# EAGLE schematic OSHW_STEPPER_DRIVER (EAGLE 6.2)
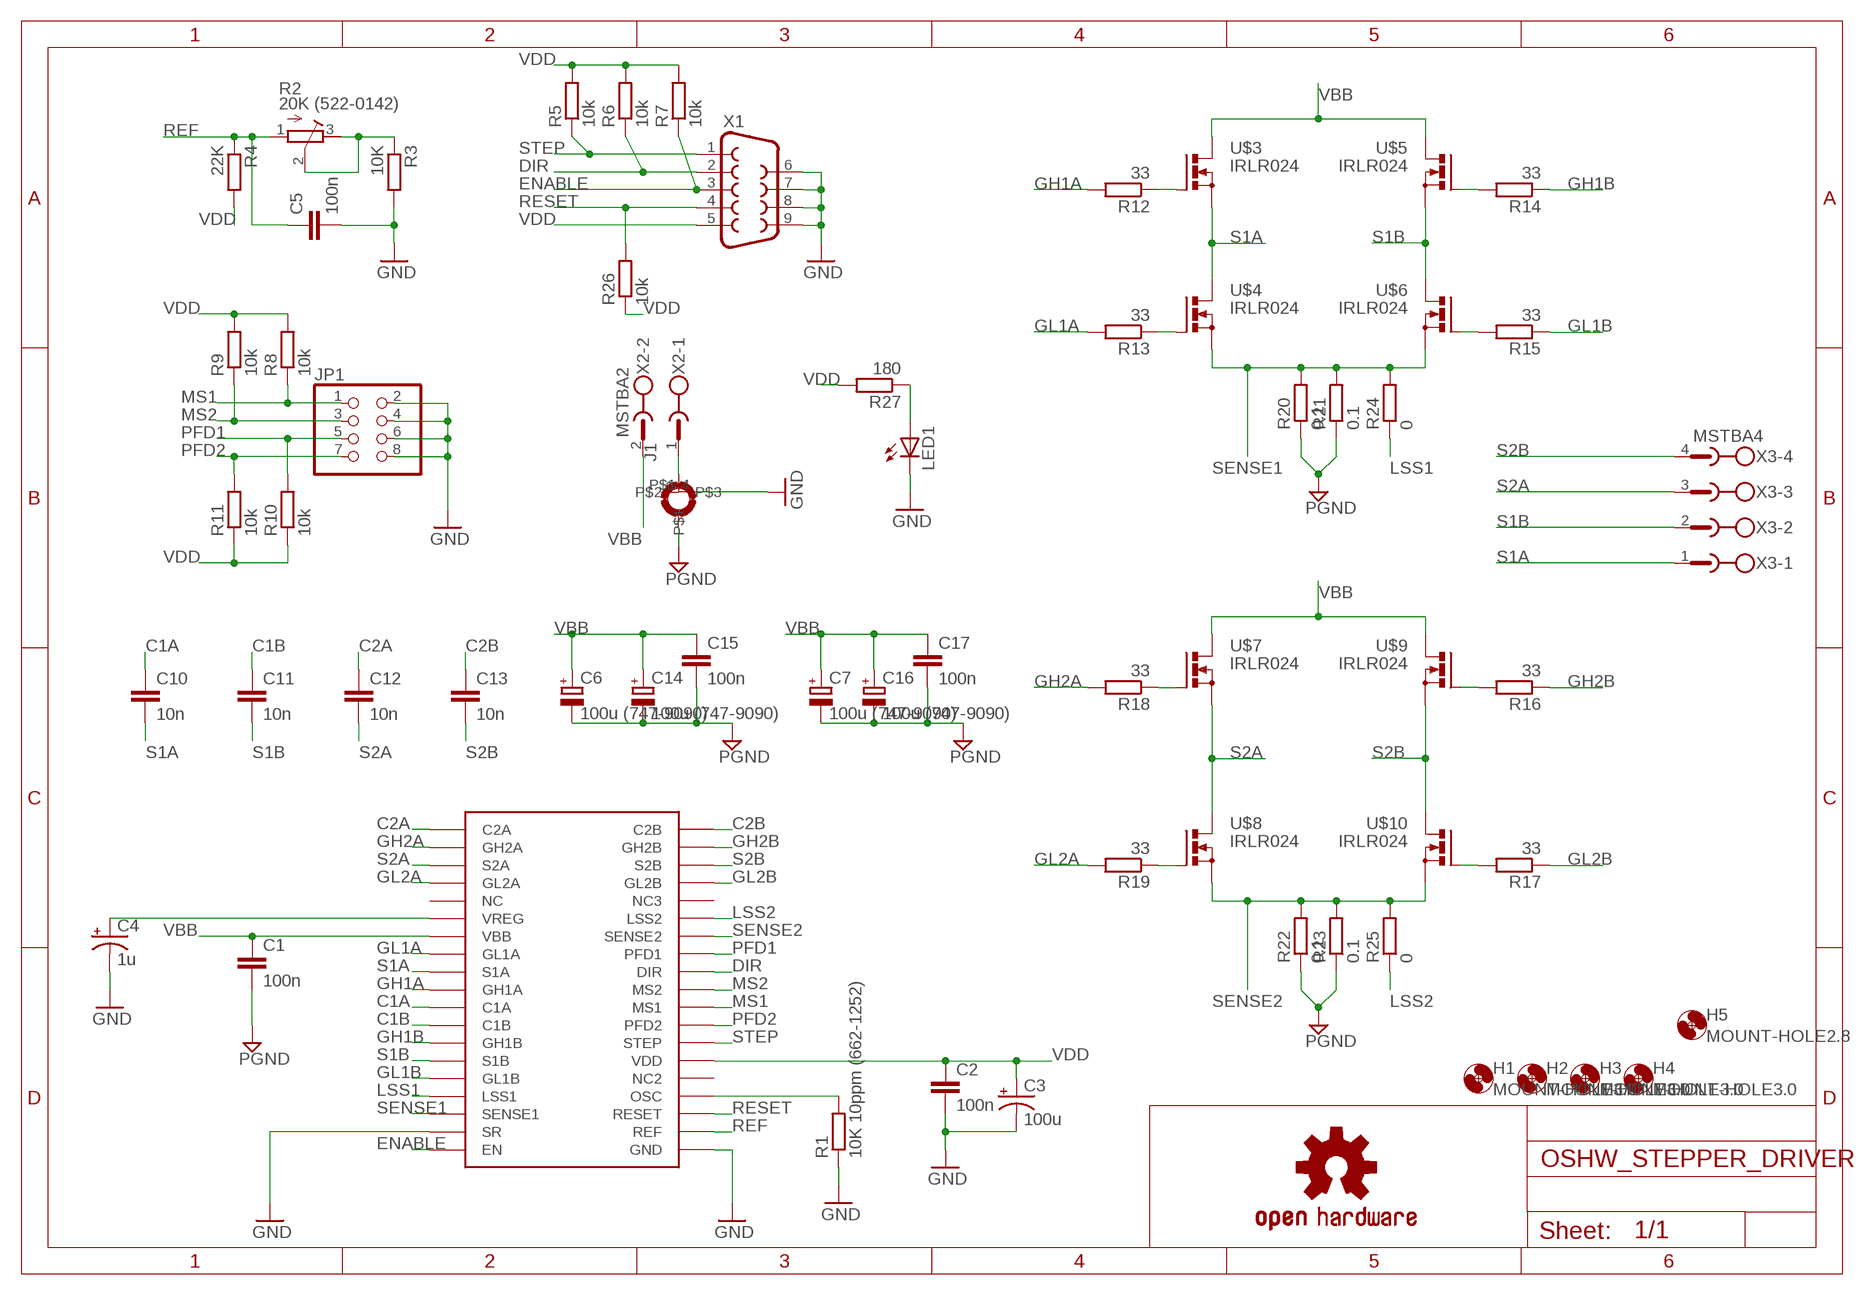
[diagram p0: schematic, sheet 1]

## Parts
C1  100n  C-EUC0805  [C0805]
C2  100n  C-EUC0805  [C0805]
C3  100u  CPOL-US153CLV-0605  [153CLV-0605]
C4  1u  CPOL-US153CLV-0405  [153CLV-0405]
C5  100n  C-EUC0805  [C0805]
C6  100u (747-9090)  CPOL-EUG  [PANASONIC_G]
C7  100u (747-9090)  CPOL-EUG  [PANASONIC_G]
C10  10n  C-EUC0805  [C0805]
C11  10n  C-EUC0805  [C0805]
C12  10n  C-EUC0805  [C0805]
C13  10n  C-EUC0805  [C0805]
C14  100u (747-9090)  CPOL-EUG  [PANASONIC_G]
C15  100n  C-EUC1210  [C1210]
C16  100u (747-9090)  CPOL-EUG  [PANASONIC_G]
C17  100n  C-EUC1210  [C1210]
H1  MOUNT-HOLE3.0  [3,0]
H2  MOUNT-HOLE3.0  [3,0]
H3  MOUNT-HOLE3.0  [3,0]
H4  MOUNT-HOLE3.0  [3,0]
H5  MOUNT-HOLE2.8  [2,8]
J1  STARBOARD_GND  [STARBOARD_GROUND]
JP1  PINHD-2X4  [2X04]
LED1  LEDSIDELED  [OSRAM-SIDELED]
R1  10K 10ppm (662-1252)  R-EU_R0805  [R0805]
R2  20K (522-0142)  R-TRIMM3296P  [RTRIM3296P]
R3  10K  R-EU_R0603  [R0603]
R4  22K  R-EU_R0603  [R0603]
R5  10k  R-EU_R0603  [R0603]
R6  10k  R-EU_R0603  [R0603]
R7  10k  R-EU_R0603  [R0603]
R8  10k  R-EU_R0603  [R0603]
R9  10k  R-EU_R0603  [R0603]
R10  10k  R-EU_R0603  [R0603]
R11  10k  R-EU_R0603  [R0603]
R12  33  R-EU_R0603  [R0603]
R13  33  R-EU_R0603  [R0603]
R14  33  R-EU_R0603  [R0603]
R15  33  R-EU_R0603  [R0603]
R16  33  R-EU_R0603  [R0603]
R17  33  R-EU_R0603  [R0603]
R18  33  R-EU_R0603  [R0603]
R19  33  R-EU_R0603  [R0603]
R20  0.1  R-EU_R2512  [R2512]
R21  0.1  R-EU_R2512  [R2512]
R22  0.1  R-EU_R2512  [R2512]
R23  0.1  R-EU_R2512  [R2512]
R24  0  R-EU_R0805  [R0805]
R25  0  R-EU_R0805  [R0805]
R26  10k  R-EU_R0603  [R0603]
R27  180  R-EU_R0603  [R0603]
U$1  OSHW-LOGOM  [OSHW-LOGO-M]
U$2  A4989  [TSSOP38]
U$3  IRLR024  [D-PAK_TO252AA]
U$4  IRLR024  [D-PAK_TO252AA]
U$5  IRLR024  [D-PAK_TO252AA]
U$6  IRLR024  [D-PAK_TO252AA]
U$7  IRLR024  [D-PAK_TO252AA]
U$8  IRLR024  [D-PAK_TO252AA]
U$9  IRLR024  [D-PAK_TO252AA]
U$10  IRLR024  [D-PAK_TO252AA]
X1  DB9FEMALE  [DB9]
X2  MSTBA2  [MSTBA2]
X3  MSTBA4  [MSTBA4]

## Nets
C1A: C10.1 U$2.P$11(C1A)
C1B: C11.1 U$2.P$12(C1B)
C2A: C12.1 U$2.P$1(C2A)
C2B: C13.1 U$2.P$38(C2B)
DIR: R6.1 U$2.P$30(DIR) X1.2
ENABLE: R7.1 U$2.P$19(EN) X1.3
GH1A: R12.2 U$2.P$10(GH1A)
GH1B: R14.1 U$2.P$13(GH1B)
GH2A: R18.2 U$2.P$2(GH2A)
GH2B: R16.1 U$2.P$37(GH2B)
GL1A: R13.2 U$2.P$8(GL1A)
GL1B: R15.1 U$2.P$15(GL1B)
GL2A: R19.2 U$2.P$4(GL2A)
GL2B: R17.1 U$2.P$35(GL2B)
GND: C2.2 C3.- C4.- C5.2 J1.1(MOUNT) JP1.2 JP1.4 JP1.6 JP1.8 LED1.C R1.1 R3.2 U$2.P$18(SR) U$2.P$20(GND) X1.6 X1.7 X1.8 X1.9 ; supply symbol labelled PGND
LSS1 [LSS (low impedance)]: R24.1 U$2.P$16(LSS1)
LSS2 [LSS (low impedance)]: R25.1 U$2.P$33(LSS2)
MS1: JP1.1 R8.1 U$2.P$28(MS1)
MS2: JP1.3 R9.1 U$2.P$29(MS2)
N$1: C4.+ U$2.P$6(VREG)
N$2: R1.2 U$2.P$23(OSC)
N$3: R2.2(S) R2.3(A) R3.1
N$4: J1.2 X2.1
N$8: R12.1 U$3.G(GATE)
N$9: R13.1 U$4.G(GATE)
N$10: R14.2 U$5.G(GATE)
N$11: R15.2 U$6.G(GATE)
N$12: R16.2 U$9.G(GATE)
N$13: R17.2 U$10.G(GATE)
N$14: R18.1 U$7.G(GATE)
N$15: R19.1 U$8.G(GATE)
N$17: LED1.A R27.1
PFD1: JP1.5 R10.2 U$2.P$31(PFD1)
PFD2: JP1.7 R11.2 U$2.P$27(PFD2)
PGND: C1.2 C6.- C7.- C14.- C15.2 C16.- C17.2 J1.4 R20.1 R21.1 R22.1 R23.1 ; supply symbol labelled GND
REF: C5.1 R2.1(E) R4.1 U$2.P$21(REF)
RESET: R26.2 U$2.P$22(RESET) X1.4
S1A [MOTOR POWER]: C10.2 U$2.P$9(S1A) U$3.S(SOURCE) U$4.D(DRAIN) U$4.DRAIN-BOTTOM(DRAIN) X3.1
S1B [MOTOR POWER]: C11.2 U$2.P$14(S1B) U$5.S(SOURCE) U$6.D(DRAIN) U$6.DRAIN-BOTTOM(DRAIN) X3.2
S2A [MOTOR POWER]: C12.2 U$2.P$3(S2A) U$7.S(SOURCE) U$8.D(DRAIN) U$8.DRAIN-BOTTOM(DRAIN) X3.3
S2B [MOTOR POWER]: C13.2 U$2.P$36(S2B) U$9.S(SOURCE) U$10.D(DRAIN) U$10.DRAIN-BOTTOM(DRAIN) X3.4
SENSE1 [MOTOR POWER]: R20.2 R21.2 R24.2 U$2.P$17(SENSE1) U$4.S(SOURCE) U$6.S(SOURCE)
SENSE2 [MOTOR POWER]: R22.2 R23.2 R25.2 U$2.P$32(SENSE2) U$8.S(SOURCE) U$10.S(SOURCE)
STEP: R5.1 U$2.P$26(STEP) X1.1
VBB [MOTOR POWER]: C1.1 C6.+ C7.+ C14.+ C15.1 C16.+ C17.1 U$2.P$7(VBB) U$3.D(DRAIN) U$3.DRAIN-BOTTOM(DRAIN) U$5.D(DRAIN) U$5.DRAIN-BOTTOM(DRAIN) U$7.D(DRAIN) U$7.DRAIN-BOTTOM(DRAIN) U$9.D(DRAIN) U$9.DRAIN-BOTTOM(DRAIN) X2.2
VDD: C2.1 C3.+ R4.2 R5.2 R6.2 R7.2 R8.2 R9.2 R10.1 R11.1 R26.1 R27.2 U$2.P$25(VDD) X1.5
Unconnected: J1.P$1 U$2.P$5(NC) U$2.P$24(NC2) U$2.P$34(NC3)

## Library data of the parts
C1 C2 C5 C10-C13 C15 C17 = rcl:C-EU: CAPACITOR, European symbol
C3 C4 = rcl:CPOL-US: POLARIZED CAPACITOR, American symbol
C6 C7 C14 C16 = rcl:CPOL-EU: POLARIZED CAPACITOR, European symbol
H1-H5 = holes:MOUNT-HOLE: MOUNTING HOLE with drill center marker
J1 = STAR_POINTS:STARBOARD_GND: StarBoard ground Pad Starboard pads sans the star cutout in top layer
JP1 = pinhead:PINHD-2X4: PIN HEADER
LED1 = led:LED: LED OSRAM: - CHIPLED LG R971, LG N971, LY N971, LG Q971, LY Q971, LO R971, LY R971 LH N974, LH R974 LS Q976, LO Q976, LY Q976 LO Q996 - Hyper CHIPLED LW Q18S LB Q993, LB Q99A, LB R99A - SideLED LS A670, LO A670, LY A670, LG A670, LP A670 LB A673, LV A673, LT A673, LW A673 LH A674 LY A675 LS A676, LA A676, LO A676, LY A676, LW A676 LS A679, LY A679, LG A679 - Hyper Micro SIDELED® LS Y876, LA Y876, LO Y876, LY Y876 LT Y87S - SmartLED LW L88C, LW L88S LB L89C, LB L89S, LG L890 LS L89K, LO L89K, LY L89K LS L896, LA L896, LO L896, LY L896 - TOPLED LS T670, LO T670, LY T670, LG T670, LP T670 LSG T670, LSP T670, LSY T670, LOP T670, LYG T670 LG T671, LOG T671, LSG T671 LB T673, LV T673, LT T673, LW T673 LH T674 LS T676, LA T676, LO T676, LY T676, LB T676, LH T676, LSB T676, LW T676 LB T67C, LV T67C, LT T67C, LS T67K, LO T67K, LY T67K, LW E67C LS E67B, LA E67B, LO E67B, LY E67B, LB E67C, LV E67C, LT E67C LW T67C LS T679, LY T679, LG T679 LS T770, LO T770, LY T770, LG T770, LP T770 LB T773, LV T773, LT T773, LW T773 LH T774 LS E675, LA E675, LY E675, LS T675 LS T776, LA T776, LO T776, LY T776, LB T776 LHGB T686 LT T68C, LB T68C - Hyper Mini TOPLED® LB M676 - Mini TOPLED Santana® LG M470 LS M47K, LO M47K, LY M47K Source: http://www.osram.convergy.de LUXEON: - LUMILED® LXK2-PW12-R00, LXK2-PW12-S00, LXK2-PW14-U00, LXK2-PW14-V00 LXK2-PM12-R00, LXK2-PM12-S00, LXK2-PM14-U00 LXK2-PE12-Q00, LXK2-PE12-R00, LXK2-PE12-S00, LXK2-PE14-T00, LXK2-PE14-U00 LXK2-PB12-K00, LXK2-PB12-L00, LXK2-PB12-M00, LXK2-PB14-N00, LXK2-PB14-P00, LXK2-PB14-Q00 LXK2-PR12-L00, LXK2-PR12-M00, LXK2-PR14-Q00, LXK2-PR14-R00 LXK2-PD12-Q00, LXK2-PD12-R00, LXK2-PD12-S00 LXK2-PH12-R00, LXK2-PH12-S00 LXK2-PL12-P00, LXK2-PL12-Q00, LXK2-PL12-R00 Source: www.luxeon.com KINGBRIGHT: KA-3528ASYC Source: www.kingbright.com
R1 R3-R27 = rcl:R-EU_: RESISTOR, European symbol
R2 = resistor:R-TRIMM: Trimm resistor
U$1 = SparkFun:OSHW-LOGO: Open Source Hardware Logo This logo indicates the piece of hardware it is found on incorporates a OSHW license and/or adheres to the definition of open source hardware found here: http://freedomdefined.org/OSHW
U$2 = A4989:A4989
U$3-U$10 = IRLR024:IRLR024
X1 = SparkFun:DB9: DB9 Connector Standard DB9 (D-Sub 9) serial connector. Can be used for CAN bus as well as RS485 and RS232. Footprint production proven. Spark Fun Electronics SKU : PRT-00429
X2 = con-phoenix-508:MSTBA2: PHOENIX; MF: FARNELL; MPN: 1757242; OC_FARNELL: 3705171; OC_NEWARK: 71C4161
X3 = con-phoenix-508:MSTBA4: PHOENIX; MF: FARNELL; MPN: 1757268; OC_FARNELL: 3705195; OC_NEWARK: 71C4163

## Net classes
0 default: width 0.254 mm
1 MOTOR POWER: width 0.254 mm, clearance 0.254 mm
2 LSS (low impedance): width 0.254 mm, clearance 0.254 mm